# EAGLE schematic deneme2 (EAGLE 9.6.2)
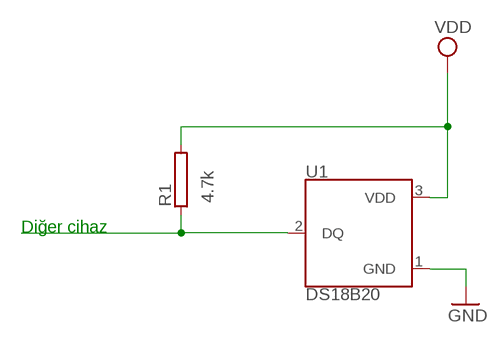
[diagram p0: schematic, sheet 1]

## Parts
R1  4.7k  RMG100-V  [TO-247-2V]
U1  DS18B20  [TO-92-TO92127P495H2044-3]

## Nets
GND: U1.1(GND)
N$2: R1.1 U1.2(DQ)
VDD: R1.2 U1.3(VDD)

## Notes on the sheet
- Diğer cihaz

## Library data of the parts
R1 = resistor-power:RMG100: TO-247 Power Resistor - RMG 100 Series Source: www.token.com.tw .. power-resistor-rmg100pdf; OC_FARNELL: unknown; OC_NEWARK: unknown
U1 = DS18B20:DS18B20: digital thermometer -55C-125C TO92-3 Check prices <https://pricing.snapeda.com/parts/DS18B20/Maxim%20Integrated/view-part?ref=eda>; AVAILABILITY: Bad; DESCRIPTION: Temperature Sensor Digital, Local -55°C ~ 125°C 12 b 8-uMAX; MF: Maxim Integrated; MP: DS18B20; PACKAGE: TO-92 Maxim Integrated; PRICE: None